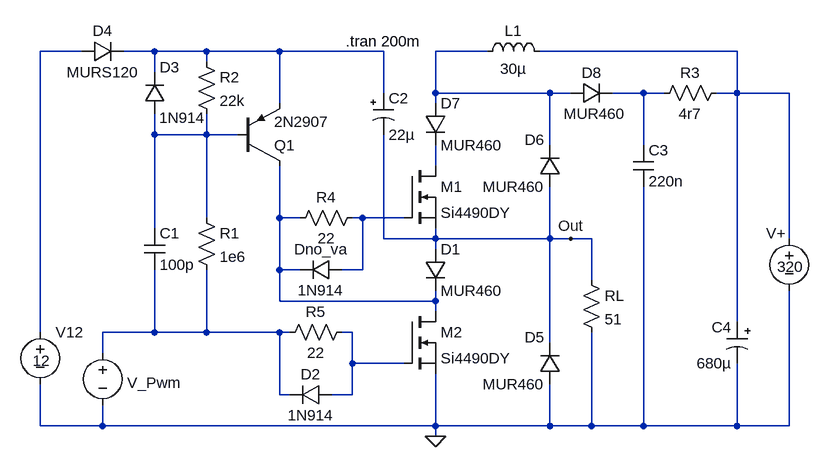
[diagram p0: schematic 1Kw50HzMosFetInverter.asc]
1Kw50HzMosFetInverter.asc, the LTspice schematic file:
Version 4
SHEET 1 908 792
WIRE -304 592 -304 160
WIRE -304 736 -304 672
WIRE -240 160 -304 160
WIRE -208 624 -208 592
WIRE -208 736 -304 736
WIRE -208 736 -208 704
WIRE -128 160 -176 160
WIRE -128 192 -128 160
WIRE -128 288 -128 256
WIRE -128 432 -128 288
WIRE -128 592 -208 592
WIRE -128 592 -128 496
WIRE -48 160 -128 160
WIRE -48 176 -48 160
WIRE -48 288 -128 288
WIRE -48 288 -48 256
WIRE -48 416 -48 288
WIRE -48 592 -128 592
WIRE -48 592 -48 496
WIRE 0 288 -48 288
WIRE 64 160 -48 160
WIRE 64 240 64 160
WIRE 64 416 64 336
WIRE 64 496 64 416
WIRE 64 544 64 496
WIRE 64 592 -48 592
WIRE 64 688 64 592
WIRE 80 592 64 592
WIRE 80 688 64 688
WIRE 96 416 64 416
WIRE 96 496 64 496
WIRE 176 592 160 592
WIRE 176 640 176 592
WIRE 176 688 144 688
WIRE 176 688 176 640
WIRE 192 416 176 416
WIRE 192 496 160 496
WIRE 192 496 192 416
WIRE 224 160 64 160
WIRE 224 224 224 160
WIRE 224 448 224 288
WIRE 256 416 192 416
WIRE 256 640 176 640
WIRE 304 224 304 160
WIRE 304 240 304 224
WIRE 304 336 304 304
WIRE 304 448 224 448
WIRE 304 448 304 432
WIRE 304 464 304 448
WIRE 304 544 64 544
WIRE 304 544 304 528
WIRE 304 560 304 544
WIRE 304 736 -208 736
WIRE 304 736 304 656
WIRE 304 752 304 736
WIRE 384 160 304 160
WIRE 480 224 304 224
WIRE 480 304 480 224
WIRE 480 448 304 448
WIRE 480 448 480 368
WIRE 480 608 480 448
WIRE 480 736 304 736
WIRE 480 736 480 672
WIRE 512 224 480 224
WIRE 512 448 480 448
WIRE 544 448 512 448
WIRE 544 512 544 448
WIRE 544 736 480 736
WIRE 544 736 544 592
WIRE 624 224 576 224
WIRE 624 304 624 224
WIRE 624 736 544 736
WIRE 624 736 624 368
WIRE 656 224 624 224
WIRE 768 160 464 160
WIRE 768 224 736 224
WIRE 768 224 768 160
WIRE 768 576 768 224
WIRE 768 736 624 736
WIRE 768 736 768 640
WIRE 848 224 768 224
WIRE 848 448 848 224
WIRE 848 736 768 736
WIRE 848 736 848 528
FLAG 304 752 0
FLAG 512 448 Out
SYMBOL nmos 256 336 R0
SYMATTR InstName M1
SYMATTR Value Si4490DY
SYMBOL diode 288 464 R0
SYMATTR InstName D1
SYMATTR Value MUR460
SYMBOL pnp2 0 336 M180
SYMATTR InstName Q1
SYMATTR Value 2N2907
SYMBOL nmos 256 560 R0
SYMATTR InstName M2
SYMATTR Value Si4490DY
SYMBOL res 176 576 R90
WINDOW 0 0 56 VBottom 0
WINDOW 3 32 56 VTop 0
SYMATTR InstName R5
SYMATTR Value 22
SYMBOL diode 144 672 R90
WINDOW 0 0 32 VBottom 0
WINDOW 3 32 32 VTop 0
SYMATTR InstName D2
SYMATTR Value 1N914
SYMBOL res 192 400 R90
WINDOW 0 0 56 VBottom 0
WINDOW 3 32 56 VTop 0
SYMATTR InstName R4
SYMATTR Value 22
SYMBOL res -64 400 R0
SYMATTR InstName R1
SYMATTR Value 1e6
SYMBOL cap -144 432 R0
SYMATTR InstName C1
SYMATTR Value 100p
SYMBOL res -64 160 R0
SYMATTR InstName R2
SYMATTR Value 22k
SYMBOL diode -144 256 M180
WINDOW 0 24 72 Left 0
WINDOW 3 23 -6 Left 0
SYMATTR InstName D3
SYMATTR Value 1N914
SYMBOL diode -240 176 R270
WINDOW 0 32 32 VTop 0
WINDOW 3 0 32 VBottom 0
SYMATTR InstName D4
SYMATTR Value MURS120
SYMBOL voltage -304 576 R0
WINDOW 3 -12 60 Left 0
SYMATTR InstName V12
SYMATTR Value 12
SYMBOL polcap 208 224 R0
WINDOW 3 24 64 Left 0
SYMATTR InstName C2
SYMATTR Value 22µ
SYMATTR Description Capacitor
SYMATTR Type cap
SYMATTR SpiceLine V=63 Irms=215m Rser=0.52 MTBF=2000 Lser=0 mfg="Nichicon" pn="UPL1J220MPH" type="Al electrolytic" ppPkg=1
SYMBOL diode 496 672 R180
WINDOW 0 24 72 Left 0
WINDOW 3 24 0 Left 0
SYMATTR InstName D5
SYMATTR Value MUR460
SYMBOL voltage -208 608 R0
WINDOW 0 38 62 Left 0
WINDOW 3 -12 60 Invisible 0
WINDOW 123 0 0 Left 0
WINDOW 39 0 0 Left 0
SYMATTR InstName V_Pwm
SYMATTR Value PULSE(0 5 0 .1u .1u 10m 20m)
SYMBOL diode 496 368 R180
WINDOW 0 24 72 Left 0
WINDOW 3 24 0 Left 0
SYMATTR InstName D6
SYMATTR Value MUR460
SYMBOL diode 288 240 R0
SYMATTR InstName D7
SYMATTR Value MUR460
SYMBOL diode 512 240 R270
WINDOW 0 32 32 VTop 0
WINDOW 3 0 37 VBottom 0
SYMATTR InstName D8
SYMATTR Value MUR460
SYMBOL ind 368 176 R270
WINDOW 0 32 56 VTop 0
WINDOW 3 5 56 VBottom 0
SYMATTR InstName L1
SYMATTR Value 30µ
SYMBOL res 752 208 R90
WINDOW 0 0 56 VBottom 0
WINDOW 3 32 56 VTop 0
SYMATTR InstName R3
SYMATTR Value 4r7
SYMBOL cap 608 304 R0
SYMATTR InstName C3
SYMATTR Value 220n
SYMBOL polcap 784 576 M0
WINDOW 3 24 64 Left 0
SYMATTR InstName C4
SYMATTR Value 680µ
SYMATTR Description Capacitor
SYMATTR Type cap
SYMATTR SpiceLine V=63 Irms=2.05 Rser=0.032 MTBF=5000 Lser=0 mfg="Nichicon" pn="UPL1J681MRH" type="Al electrolytic" ppPkg=1
SYMBOL res 528 496 R0
SYMATTR InstName RL
SYMATTR Value 51
SYMBOL voltage 848 432 R0
WINDOW 0 -35 8 Left 0
WINDOW 3 -18 59 Left 0
SYMATTR InstName V+
SYMATTR Value 320
SYMBOL diode 160 480 R90
WINDOW 0 0 32 VBottom 0
WINDOW 3 32 32 VTop 0
SYMATTR InstName Dno_va
SYMATTR Value 1N914
TEXT 166 144 Left 0 !.tran 200m

The netlist it stands for:
* 1Kw50HzMosFetInverter.asc
M1 N009 N007 Out Out Si4490DY
D1 Out N005 MUR460
Q1 N005 N004 N003 0 2N2907
M2 N005 N006 0 0 Si4490DY
R5 N006 N002 22
D2 N006 N002 1N914
R4 N007 N005 22
R1 N004 N002 1e6
C1 N004 N002 100p
R2 N003 N004 22k
D3 N004 N003 1N914
D4 N001 N003 MURS120
V12 N001 0 12
C2 N003 Out 22µ V=63 Irms=215m Rser=0.52 MTBF=2000 Lser=0 mfg="Nichicon" pn="UPL1J220MPH" type="Al electrolytic" ppPkg=1
D5 0 Out MUR460
V_Pwm N002 0 PULSE(0 5 0 .1u .1u 10m 20m)
D6 Out N008 MUR460
D7 N008 N009 MUR460
D8 N008 N010 MUR460
L1 N008 N011 30µ
R3 N011 N010 4r7
C3 N010 0 220n
C4 N011 0 680µ V=63 Irms=2.05 Rser=0.032 MTBF=5000 Lser=0 mfg="Nichicon" pn="UPL1J681MRH" type="Al electrolytic" ppPkg=1
RL Out 0 51
V+ N011 0 320
Dno_va N007 N005 1N914
.model D D
.lib standard.dio
.model NPN NPN
.model PNP PNP
.lib standard.bjt
.model NMOS NMOS
.model PMOS PMOS
.lib standard.mos
.tran 200m
.backanno
.end